# EAGLE design perica3 (EAGLE 7.7.0)
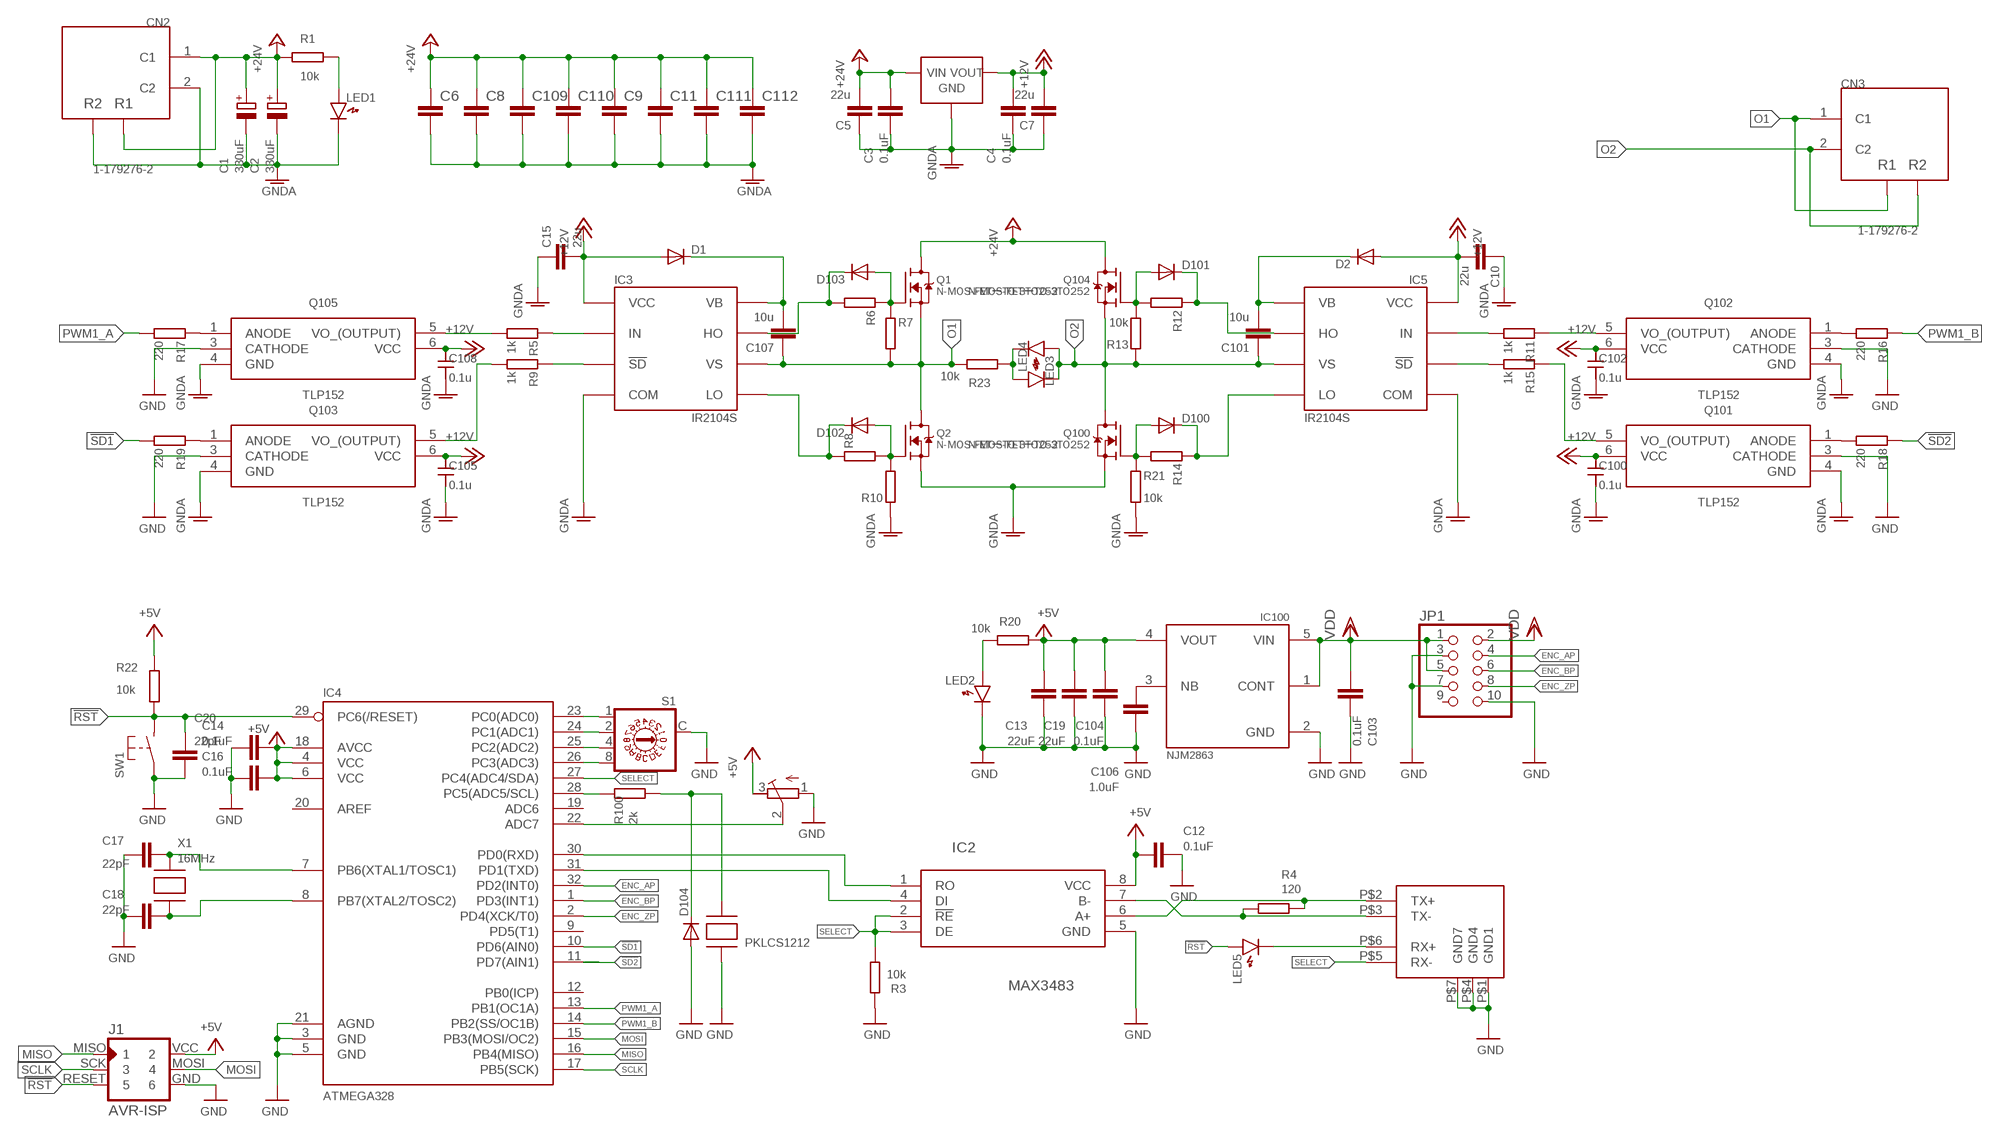
[diagram p0: schematic, sheet 1]

## Parts
C1  330uF  CPOL-EUUD-10X10  [UD-10X10_NICHICON]
C2  330uF  CPOL-EUUD-10X10  [UD-10X10_NICHICON]
C3  0.1uF  C-EUC0603K  [C0603K]
C4  0.1uF  C-EUC0603K  [C0603K]
C5  22u  C-EUC1206K  [C1206K]
C6  C-EUC1206  [C1206]
C7  22u  C-EUC1206K  [C1206K]
C8  C-EUC1206  [C1206]
C9  C-EUC1206  [C1206]
C10  22u  C-EUC1206K  [C1206K]
C11  C-EUC1206  [C1206]
C12  0.1uF  C-EUC0603K  [C0603K]
C13  22uF  C-EUC0805K  [C0805K]
C14  0.1uF  C-EUC0603K  [C0603K]
C15  22u  C-EUC1206K  [C1206K]
C16  0.1uF  C-EUC0603K  [C0603K]
C17  22pF  C-EUC0603K  [C0603K]
C18  22pF  C-EUC0603K  [C0603K]
C19  22uF  C-EUC0805K  [C0805K]
C20  22pF  C-EUC0603K  [C0603K]
C100  0.1u  CAPACTOR1608  [SMD1608]
C101  10u  C-EUC1206K  [C1206K]
C102  0.1u  CAPACTOR1608  [SMD1608]
C103  0.1uF  C-EUC0603K  [C0603K]
C104  0.1uF  C-EUC0603K  [C0603K]
C105  0.1u  CAPACTOR1608  [SMD1608]
C106  1.0uF  C-EUC0603K  [C0603K]
C107  10u  C-EUC1206K  [C1206K]
C108  0.1u  CAPACTOR1608  [SMD1608]
C109  C-EUC1206  [C1206]
C110  C-EUC1206  [C1206]
C111  C-EUC1206  [C1206]
C112  C-EUC1206  [C1206]
CN1  SATA  [SATA_MOLEX_LLC_0470804001]
CN2  1-179276-2  [1-179276-2]
CN3  1-179276-2  [1-179276-2]
D1  DIODE-SOD123  [SOD123]
D2  DIODE-SOD123  [SOD123]
D100  DIODE-SOD123  [SOD123]
D101  DIODE-SOD123  [SOD123]
D102  DIODE-SOD123  [SOD123]
D103  DIODE-SOD123  [SOD123]
D104  DIODE-SOD123  [SOD123]
IC1  NJM78XX  [TO252]
IC2  MAX3483  MAX3488  [SO-8]
IC3  IR2104S  [SO-8]
IC4  ATMEGA328  [TQFP32-08]
IC5  IR2104S  [SO-8]
IC100  NJM2863  [SOT-23-5]
J1  AVR-ISP  AVR-ISP-6PINAVR-ISP-6PIN-SMALL-SILK  [AVR-ISP-6PIN-SMAILL-SILK]
JP1  PINHD-2X5  [2X05]
LED1  RED  LED  [LED_1608]
LED2  RED  LED  [LED_1608]
LED3  RED  LED  [LED_1608]
LED4  RED  LED  [LED_1608]
LED5  RED  LED  [LED_1608]
Q1  N-MOS-FETーTO-3TO252  [TO252]
Q2  N-MOS-FETーTO-3TO252  [TO252]
Q100  N-MOS-FETーTO-3TO252  [TO252]
Q101  TLP152  TLP2309  [11-4L1S(5-PIN-SOIC)]
Q102  TLP152  TLP2309  [11-4L1S(5-PIN-SOIC)]
Q103  TLP152  TLP2309  [11-4L1S(5-PIN-SOIC)]
Q104  N-MOS-FETーTO-3TO252  [TO252]
Q105  TLP152  TLP2309  [11-4L1S(5-PIN-SOIC)]
R1  10k  REGISTER1068  [SMD1608]
R2  10k-20k  R-TRIMM4G/J  [RTRIM4G/J]
R3  10k  REGISTER1068  [SMD1608]
R4  120  REGISTER1068  [SMD1608]
R5  1k  REGISTER1068  [SMD1608]
R6  REGISTER1068  [SMD1608]
R7  REGISTER1068  [SMD1608]
R8  REGISTER1068  [SMD1608]
R9  1k  REGISTER1068  [SMD1608]
R10  REGISTER1068  [SMD1608]
R11  1k  REGISTER1068  [SMD1608]
R12  REGISTER1068  [SMD1608]
R13  10k  REGISTER1068  [SMD1608]
R14  REGISTER1068  [SMD1608]
R15  1k  REGISTER1068  [SMD1608]
R16  220  REGISTER1068  [SMD1608]
R17  220  REGISTER1068  [SMD1608]
R18  220  REGISTER1068  [SMD1608]
R19  220  REGISTER1068  [SMD1608]
R20  10k  REGISTER1068  [SMD1608]
R21  10k  REGISTER1068  [SMD1608]
R22  10k  REGISTER1068  [SMD1608]
R23  10k  REGISTER1068  [SMD1608]
R100  2k  REGISTER1068  [SMD1608]
S1  P103  [P103]
SW1  TUCT_SW_MINI  [SW1]
X1  16MHz  XTALNX5032  [NX5032]
Z1  PKLCS1212  [PKLCS1212]

## Nets
!RST: C20.2 IC4.29(PC6(/RESET)) J1.RESET LED5.A R22.1 SW1.P$2(S)
!SD1: IC4.10(PD6(AIN0)) R19.2
!SD2: IC4.11(PD7(AIN1)) R18.1
+5V: C12.2 C13.1 C14.2 C16.2 C19.1 C104.2 IC2.8(VCC) IC4.4(VCC) IC4.6(VCC) IC4.18(AVCC) IC100.4(VOUT) J1.VCC R2.3(E) R20.2 R22.2
+12V: C4.2 C7.2 C10.2 C15.2 C100.1 C102.1 C105.1 C108.1 D1.A D2.A IC1.2(VOUT) IC3.1(VCC) IC5.1(VCC) Q101.6(VCC) Q102.6(VCC) Q103.6(VCC) Q105.6(VCC)
+24V: C1.+ C2.+ C3.2 C5.2 C6.1 C8.1 C9.1 C11.1 C109.1 C110.1 C111.1 C112.1 CN2.1(C1) CN2.4(R1) IC1.1(VIN) Q1.3(D) Q104.3(D) R1.2
ENC_AP: IC4.32(PD2(INT0)) JP1.4
ENC_BP: IC4.1(PD3(INT1)) JP1.6
ENC_ZP: IC4.2(PD4(XCK/T0)) JP1.8
G1_HIS: D103.A Q1.1(G) R6.1 R7.1
G1_LOS: D100.A Q100.1(G) R14.2 R21.1
G2_HIS: D101.A Q104.1(G) R12.2 R13.2
G2_LOS: D102.A Q2.1(G) R8.2 R10.2
GND: C12.1 C13.2 C14.1 C16.1 C17.1 C18.1 C19.2 C20.1 C103.1 C104.1 C106.1 CN1.P$1(GND1) CN1.P$4(GND4) CN1.P$7(GND7) D104.A IC2.5(GND) IC4.3(GND) IC4.5(GND) IC4.21(AGND) IC100.2(GND) J1.GND JP1.3 JP1.7 JP1.10 LED2.K Q101.3(CATHODE) Q102.3(CATHODE) Q103.3(CATHODE) Q105.3(CATHODE) R2.1(A) R3.2 S1.C SW1.P$1(P) Z1.P$2
GNDA: C1.- C2.- C3.1 C4.1 C5.1 C6.2 C7.1 C8.2 C9.2 C10.1 C11.2 C15.1 C100.2 C102.2 C105.2 C108.2 C109.2 C110.2 C111.2 C112.2 CN2.2(C2) CN2.3(R2) IC1.3(GND) IC3.4(COM) IC5.4(COM) LED1.K Q2.2(S) Q100.2(S) Q101.4(GND) Q102.4(GND) Q103.4(GND) Q105.4(GND) R10.1 R21.2
MISO: IC4.16(PB4(MISO)) J1.MISO
MOSI: IC4.15(PB3(MOSI/OC2)) J1.MOSI
N$1: IC3.2(IN) R5.1
N$2: IC4.26(PC3(ADC3)) S1.8
N$3: IC4.25(PC2(ADC2)) S1.4
N$4: C107.2 D1.C IC3.8(VB)
N$5: D103.C IC3.7(HO) R6.2
N$6: C17.2 IC4.7(PB6(XTAL1/TOSC1)) X1.P$2
N$7: C18.2 IC4.8(PB7(XTAL2/TOSC2)) X1.P$1
N$8: D101.C IC5.7(HO) R12.1
N$9: IC4.24(PC1(ADC1)) S1.2
N$10: D100.C IC5.5(LO) R14.1
N$11: D102.C IC3.5(LO) R8.1
N$12: IC4.23(PC0(ADC0)) S1.1
N$13: C101.2 D2.C IC5.8(VB)
N$14: IC3.3(!SD) R9.1
N$15: IC5.2(IN) R11.2
N$16: IC5.3(!SD) R15.2
N$17: Q105.1(ANODE) R17.1
N$18: Q102.5(VO_(OUTPUT)) R11.1
N$19: Q101.5(VO_(OUTPUT)) R15.1
N$20: Q105.5(VO_(OUTPUT)) R5.2
N$21: Q103.5(VO_(OUTPUT)) R9.2
N$22: Q103.1(ANODE) R19.1
N$23: Q102.1(ANODE) R16.2
N$24: Q101.1(ANODE) R18.2
N$25: IC4.28(PC5(ADC5/SCL)) R100.2
N$26: D104.C R100.1 Z1.P$1
N$27: LED2.A R20.1
N$28: CN1.P$6(RX+) LED5.K
N$29: C106.2 IC100.3(NB)
N$30: LED1.A R1.1
N$31: CN1.P$2(TX+) IC2.6(A+) R4.1
N$32: LED3.K LED4.A R23.2
N$33: IC4.22(ADC7) R2.2(S)
N$34: CN1.P$3(TX-) IC2.7(B-) R4.2
O1: C107.1 CN3.1(C1) CN3.4(R1) IC3.6(VS) Q1.2(S) Q2.3(D) R7.2 R23.1
O2: C101.1 CN3.2(C2) CN3.3(R2) IC5.6(VS) LED3.A LED4.K Q100.3(D) Q104.2(S) R13.1
PWM1_A: IC4.13(PB1(OC1A)) R17.2
PWM1_B: IC4.14(PB2(SS/OC1B)) R16.1
RXD: IC2.4(DI) IC4.31(PD1(TXD))
SCLK: IC4.17(PB5(SCK)) J1.SCK
SELECT: CN1.P$5(RX-) IC2.2(!RE) IC2.3(DE) IC4.27(PC4(ADC4/SDA)) R3.1
TXD: IC2.1(RO) IC4.30(PD0(RXD))
VDD: C103.2 IC100.1(CONT) IC100.5(VIN) JP1.1 JP1.2 JP1.5
Unconnected: IC4.9(PD5(T1)) IC4.12(PB0(ICP)) IC4.19(ADC6) IC4.20(AREF) JP1.9

## Library data of the parts
C1 C2 = rcl:CPOL-EU: POLARIZED CAPACITOR, European symbol
C3 C4 C12-C14 C16-C20 C103 C104 C106 = resistor:C-EU: CAPACITOR, European symbol
C5-C11 C15 C101 C107 C109-C112 = rcl:C-EU: CAPACITOR, European symbol
C100 C102 C105 C108 = FUGU_GENERIC:CAPACTOR
CN1 = FUGU:SATA: Seriaal ATA Connecter
CN2 CN3 = FUGU:1-179276-2: AMP DYNAMIC D-3200; MANUFACTURER_PART_NUMBER: 11792762; VENDOR: Tyco Electronics
D1 D2 D100-D104 = diode:DIODE-: DIODE
IC1 = FUGU_LSI:NJM78XX
IC2 = FUGU_LSI:MAX3488: 3.3V-Powered, 10Mbps and Slew-Rate-Limited True RS-485/RS-422 Transceivers
IC3 IC5 = FUGU_LSI:IR2104: high voltage, high speed power MOSFET and IGBT drivers.
IC4 = FUGU_LSI:ATMEGA328: High Performance, Low Power AVR 8-Bit Microcontroller
IC100 = FUGU_LSI:NJM2863: Low Noize Low Drop Out Voltage Regulator
J1 = avr-isp:AVR-ISP-6PIN: AVR ISP 6pin 3x2 pin header
JP1 = pinhead:PINHD-2X5: PIN HEADER
LED1-LED5 = FUGU_GENERIC:LED
Q1 Q2 Q100 Q104 = FUGU:N-MOS-FETーTO-3: Nchannel MOS FET
Q101-Q103 Q105 = TLP2309:TLP2309: Toshiba TLP2309 AC Input Transistor Output Optocoupler, Surface Mount, 5-Pin SOIC <https://componentsearchengine.com/Images/3/TLP2309.jpg> Source: Datasheet <https://toshiba.semicon-storage.com/info/docget.jsp?did=8380&prodName=TLP2309>; DESCRIPTION: Toshiba TLP2309 AC Input Transistor Output Optocoupler, Surface Mount, 5-Pin SOIC; HEIGHT: mm; MANUFACTURER_NAME: Toshiba; MANUFACTURER_PART_NUMBER: TLP2309; RS_PART_NUMBER: 7965241P; SUPPLIER_NAME: RS
R1 R3-R23 R100 = FUGU_GENERIC:REGISTER
R2 = resistor:R-TRIMM: Trimm resistor
S1 = switch-dil:P103: DIL/CODE SWITCH; OC_FARNELL: unknown; OC_NEWARK: unknown
SW1 = FUGU:TUCT_SW_MINI: TVBP06
X1 = adafruit:XTAL: Low cost SMT crystals, no capacitors included http://www.ladyada.net/library/eagle
Z1 = FUGU:PKLCS1212: murata small piezoelectric buzzer

## Board
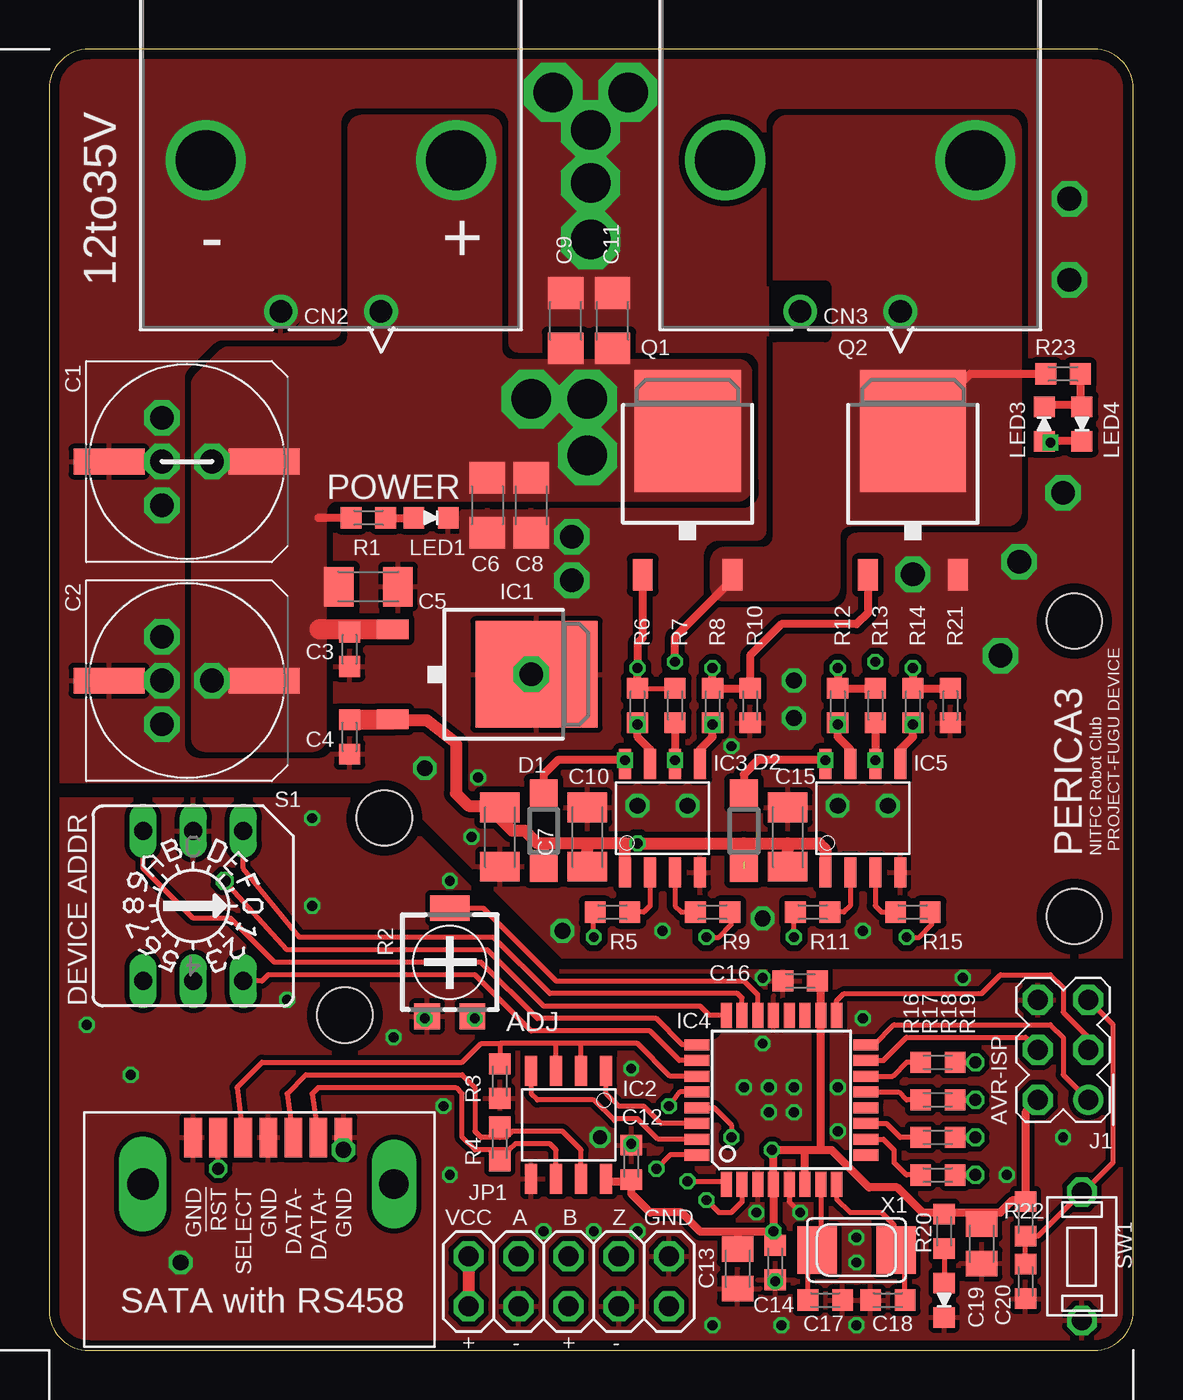
[diagram p1: board, top side]
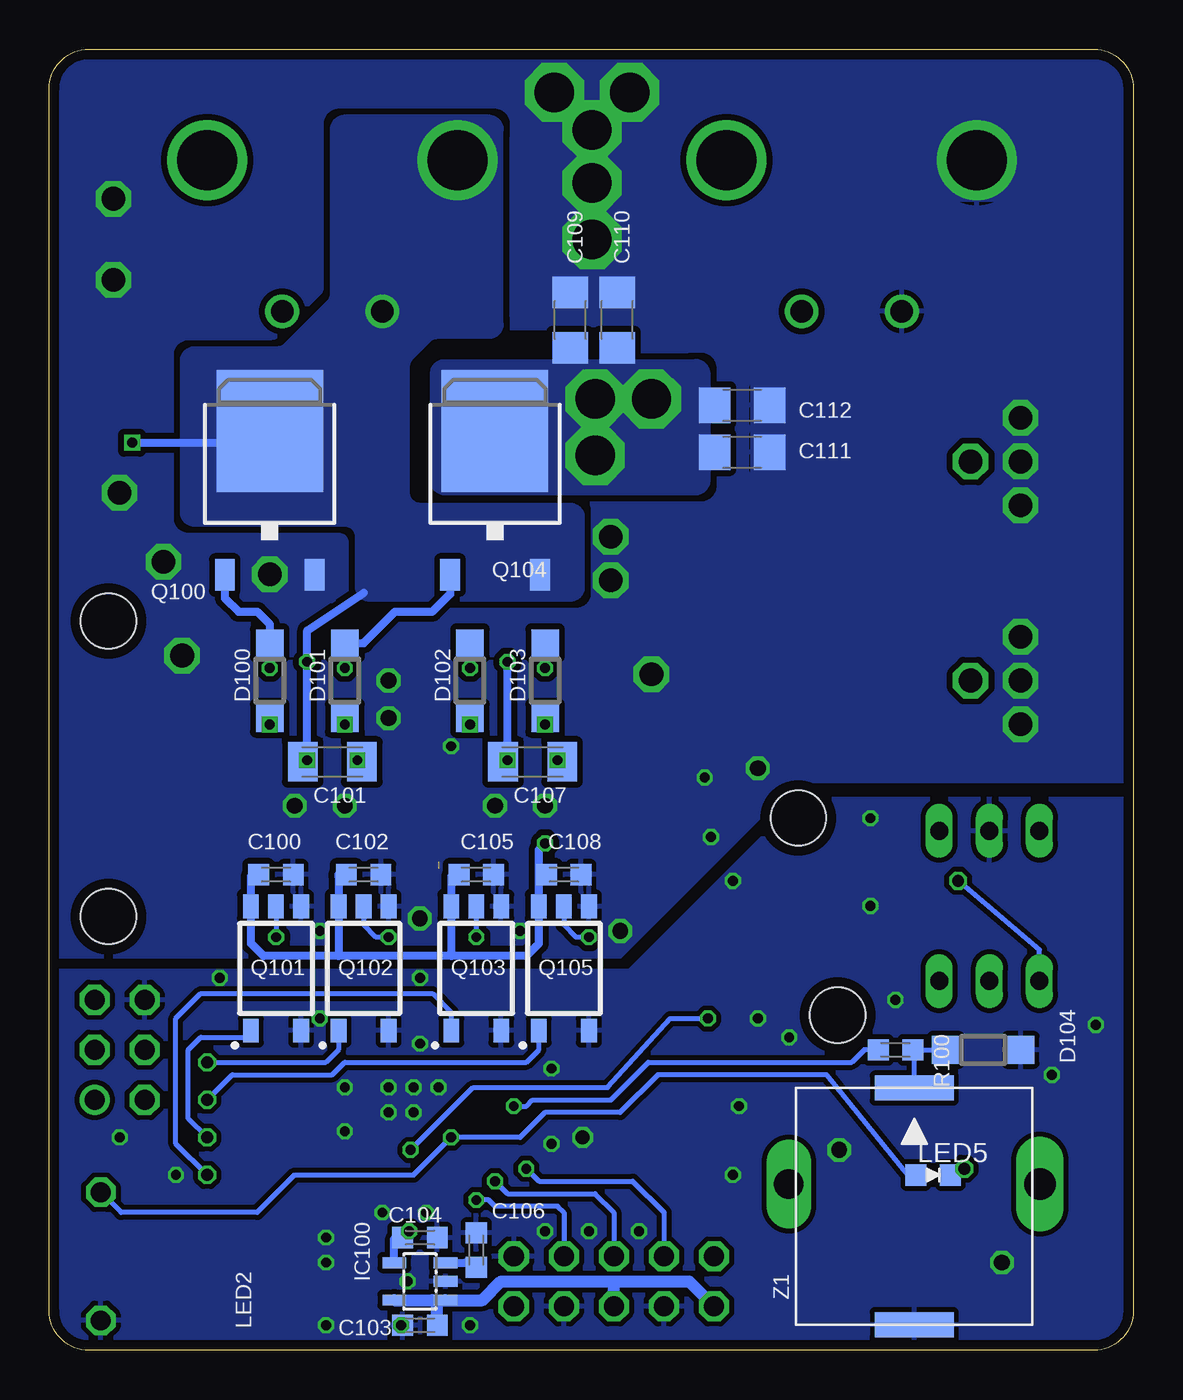
[diagram p2: board, bottom side, seen from below]

Size 55 x 66 mm. Coordinates in mm from the lower left corner, seen from the top.
Outline: 2,0 53,0 arc90 55,2 55,64 arc90 53,66 2,66 arc90 0,64 0,2 arc90 2,0
Copper layers (1*16): Top 0.035mm / dielectric 1.6mm / Bottom 0.035mm
Design rules "Elecrow_2-layer_PCB_eagle_rule": minimum track width 6mil, minimum drill 12mil, track to track 6mil, track to pad 6mil, pad to pad 6mil, via to via 8mil, smd to smd 0mil, copper to edge 20mil, drill to drill 10mil, minimum pad ring 6mil, minimum via ring 6mil, stop-mask expansion 0mil, vias tented up to drill 100mil, thermal gap 10mil
Holes 2.8 mm at 15,17 52,22 17,27 52,37
tRestrict: area 36.8,51.4 to 39.4,54; 4 lines
bRestrict: 1 lines

### Footprints (pad centres in the part's own frame; a part is rotated, then mirrored left to right if it is on the bottom)
UD-10X10_NICHICON = smd 3.6 x 1.3: + 3.925,0; - -3.95,0
C0603K = smd 1.05 x 1.08: 1 -0.875,0; 2 0.875,0
C1206K = smd 1.5 x 2: 1 -1.5,0; 2 1.5,0
C1206 = smd 1.6 x 1.8: 1 -1.4,0; 2 1.4,0
C0805K = smd 1.3 x 1.6: 1 -1,0; 2 1,0
SMD1608 = smd 1.05 x 1.08: 1 -0.875,0; 2 0.875,0
SATA_MOLEX_LLC_0470804001 = smd 0.9 x 2: P$1 3.81,5.08; P$2 2.54,5.08; P$3 1.27,5.08; P$4 0,5.08; P$5 -1.27,5.08; P$6 -2.54,5.08; P$7 -3.81,5.08 | drill 1.6 long: P$8 -6.37,2.72 | drill 1.5 long: P$9 6.37,2.72
1-179276-2 = drill 1.143 pad 1.397: 1 5.08,0; 2 0,0 | drill 3.048 pad 3.556: 3 -3.81,7.671; 4 8.89,7.671
SOD123 = smd 1.4 x 1.4: A 1.9,0; C -1.9,0
TO252 = smd 1 x 1.6: 1 -2.28,-4.8; 2 2.28,-4.8 | smd 5.4 x 6.2: 3 0,2.5
SO-8 = smd 1.524 x 0.61: 1 -2.743,1.905; 2 -2.743,0.635; 3 -2.743,-0.635; 4 -2.743,-1.905; 5 2.743,-1.905; 6 2.743,-0.635; 7 2.743,0.635; 8 2.743,1.905
TQFP32-08 = smd 1.27 x 0.559: 1 -4.293,2.8; 2 -4.293,2; 3 -4.293,1.2; 4 -4.293,0.4; 5 -4.293,-0.4; 6 -4.293,-1.2; 7 -4.293,-2; 8 -4.293,-2.8; 17 4.293,-2.8; 18 4.293,-2; 19 4.293,-1.2; 20 4.293,-0.4; 21 4.293,0.4; 22 4.293,1.2; 23 4.293,2; 24 4.293,2.8 | smd 0.559 x 1.27: 9 -2.8,-4.293; 10 -2,-4.293; 11 -1.2,-4.293; 12 -0.4,-4.293; 13 0.4,-4.293; 14 1.2,-4.293; 15 2,-4.293; 16 2.8,-4.293; 25 2.8,4.293; 26 2,4.293; 27 1.2,4.293; 28 0.4,4.293; 29 -0.4,4.293; 30 -1.2,4.293; 31 -2,4.293; 32 -2.8,4.293
SOT-23-5 = smd 0.55 x 1.2: 1 -0.95,-1.3; 2 0,-1.3; 3 0.95,-1.3; 4 0.95,1.3; 5 -0.95,1.3
AVR-ISP-6PIN-SMAILL-SILK = drill 1.016 octagon: GND 1.27,-2.54; MOSI 1.27,0; RESET -1.27,-2.54; SCK -1.27,0; VCC 1.27,2.54 | drill 1.016: MISO -1.27,2.54
2X05 = drill 1.016 octagon: 1 -5.08,-1.27; 2 -5.08,1.27; 3 -2.54,-1.27; 4 -2.54,1.27; 5 0,-1.27; 6 0,1.27; 7 2.54,-1.27; 8 2.54,1.27; 9 5.08,-1.27; 10 5.08,1.27
LED_1608 = smd 1.05 x 1.08: A -0.875,0; K 0.875,0
11-4L1S(5-PIN-SOIC) = smd 0.8 x 1.2: 1 -1.27,-3.15; 3 1.27,-3.15; 4 1.27,3.15; 5 0,3.15; 6 -1.27,3.15
RTRIM4G/J = smd 1.3 x 1.3: 1 -1.15,-2.75; 3 1.15,-2.75 | smd 2 x 1.3: 2 0,2.75
P103 = drill 0.914 long: 1 3.81,-2.54; 2 -3.81,2.54; 4 3.81,2.54; 8 -3.81,-2.54; C 3.81,0; C1 -3.81,0
SW1 = drill 1 octagon: P$1 0,-3.25; P$2 0,3.25
NX5032 = smd 2 x 2.4: P$1 2,0; P$2 -2,0
PKLCS1212 = smd 1.27 x 4: P$1 6,0; P$2 -6,0

### Placement (x,y rotation side)
C1  6.99,45.09 0 top
C2  6.99,33.97 0 top
C3  15.24,35.56 90 top
C4  15.24,31.11 90 top
C5  16.19,38.73 180 top
C6  22.23,42.86 270 top
C7  22.86,26.04 90 top
C8  24.45,42.86 270 top
C9  26.19,52.23 90 top
C10  27.3,26.04 270 top
C11  28.57,52.23 90 top
C12  29.53,9.53 270 top
C13  34.92,4.13 270 top
C14  36.83,4.45 90 top
C15  37.47,26.04 270 top
C16  38.1,18.73 0 top
C17  39.37,2.54 180 top
C18  42.55,2.54 0 top
C19  47.31,5.4 270 top
C20  49.53,3.49 90 top
C100  43.5,24.13 0 bottom
C101  40.64,29.84 0 bottom
C102  39.05,24.13 0 bottom
C103  36.2,1.27 0 bottom
C104  36.2,5.71 180 bottom
C105  33.34,24.13 0 bottom
C106  33.34,5.08 270 bottom
C107  30.48,29.84 0 bottom
C108  28.89,24.13 0 bottom
C109  28.57,52.26 90 bottom
C110  26.19,52.26 90 bottom
C111  19.84,45.56 0 bottom
C112  19.84,47.94 0 bottom
CN1  11.11,5.71 0 top
CN2  11.75,52.7 0 top
CN3  38.1,52.7 0 top
D1  25.08,26.35 270 top
D2  35.24,26.35 270 top
D100  43.81,33.97 90 bottom
D101  40.01,33.97 90 bottom
D102  33.66,33.97 90 bottom
D103  29.84,33.97 90 bottom
D104  7.62,15.24 0 bottom
IC1  22.23,34.29 270 top
IC2  26.35,11.43 270 top
IC3  31.11,26.99 90 top
IC4  37.15,12.7 90 top
IC5  41.27,26.99 90 top
IC100  36.2,3.49 90 bottom
J1  51.44,15.24 180 top
JP1  26.35,3.49 0 top
LED1  19.37,42.23 0 top
LED2  45.4,2.54 270 top
LED3  50.48,46.99 90 top
LED4  52.39,46.99 270 top
LED5  10.16,8.89 0 bottom
Q1  32.38,44.13 0 top
Q2  43.81,44.13 0 top
Q100  43.81,44.13 0 bottom
Q101  43.5,19.37 0 bottom
Q102  39.05,19.37 0 bottom
Q103  33.34,19.37 0 bottom
Q104  32.38,44.13 0 bottom
Q105  28.89,19.37 0 bottom
R1  16.19,42.23 180 top
R2  20.32,19.68 0 top
R3  22.86,13.65 270 top
R4  22.86,10.48 90 top
R5  28.57,22.23 180 top
R6  29.84,32.7 270 top
R7  31.75,32.7 270 top
R8  33.66,32.7 90 top
R9  33.66,22.23 0 top
R10  35.56,32.7 90 top
R11  38.73,22.23 0 top
R12  40.01,32.7 90 top
R13  41.91,32.7 90 top
R14  43.81,32.7 90 top
R15  43.81,22.23 180 top
R16  45.09,14.61 0 top
R17  45.09,12.7 180 top
R18  45.09,10.79 0 top
R19  45.09,8.89 180 top
R20  45.4,6.03 90 top
R21  45.72,32.7 270 top
R22  49.53,6.67 90 top
R23  51.44,49.53 0 top
R100  12.06,15.24 180 bottom
S1  7.3,22.54 90 top
SW1  52.39,4.76 0 top
X1  40.96,5.08 0 top
Z1  11.11,7.3 90 bottom

### Tracks (layer width: path | path; a pad name or v marks a point on that pad's centre or on a via)
!RST  (via drill 0.5)
  Top 0.254: C20.2 R22.1 50.17,5.79 SW1.P$2 52.46,8.01 53.98,9.53 53.98,16.51 J1.RESET | IC4.29 33.74,12.3 34.61,11.43 v34.61,10.79
  Bottom 0.254: SW1.P$2 51.36,6.99 44.45,6.99 42.55,8.89 36.51,8.89 v34.61,10.79 31.11,10.79 29.84,12.06 26.04,12.06 24.13,13.97 15.56,13.97 11.43,8.89 LED5.A
!SD1
  Top 0.254: R19.2 43.5,8.89 42.86,9.53 42.86,10.16 42.32,10.7 IC4.10
!SD2
  Top 0.254: R18.1 43.18,10.79 42.48,11.5 IC4.11
+5V  (via drill 0.5)
  Top 0.254: 39.15,10.26 39.69,10.16 | R2.3 21.48,16.93 v21.59,16.83
  Top 0.406: 38.26,10.16 v36.67,10.16 36.75,10.08 IC4.4 v36.75,6.03 | 38.26,10.16 39.69,10.16 41.59,8.26 43.02,8.26 44.29,6.99 45.33,6.99 | 39.15,10.26 IC4.18 39.15,18.56 C16.2 | 45.33,6.99 47.62,6.99 | J1.VCC 49.53,12.06 R22.2 49.45,7.62 48.9,7.62 48.26,6.99 47.62,6.99 | C19.1 47.62,6.99 | 29.56,8.69 C12.2 | 28.29,8.65 IC2.8 28.37,8.57 29.21,8.57 29.21,8.37 | C12.2 29.21,8.37 | 29.21,8.37 29.32,8.37 | 45.33,6.99 R20.2 | 34.92,6.03 v36.75,6.03 | 34.92,6.03 33.02,6.03 32.07,6.99 30.48,6.99 29.53,7.94 C12.2 | 34.92,6.03 C13.1 | v36.75,6.03 36.75,5.4 C14.2 | IC4.6 38.35,10.09 38.26,10.16
  Top 0.61: 29.61,8.57 C12.2
  Bottom 0.254: v36.67,10.16 33.5,13.34 26.67,13.34 23.5,16.83 v21.59,16.83 | C104.2 v36.75,6.03
  Bottom 0.406: IC100.4 37.49,5.67 C104.2 37.23,5.79
+12V  (via drill 0.5)  (1 unrouted)
  Top 0.152: 35.56,24.77 D2.A
  Top 0.61: 29.21,25.72 v29.84,25.72 35.24,25.72 | 35.24,25.72 37.47,25.72 | 37.47,25.72 39.05,25.72 39.37,25.4 IC5.1 | C15.2 37.47,25.72 | IC3.1 29.21,25.72 | 29.21,25.72 27.3,25.72 | 27.3,25.72 25.08,25.72 | 25.08,25.72 24.77,25.72 24.13,26.35 23.5,26.35 22.86,26.99 C7.2 22.77,27.62 21.27,27.62 20.64,28.26 20.64,30.8 19.14,31.97 17.46,31.97 IC1.2 | C10.2 27.3,25.72 | 35.24,25.72 35.24,24.77 | D1.A 25.08,25.72
  Top 1.016: C4.2 17.41,31.99 IC1.2
  Bottom 0.406: C105.1 34.61,24.05 Q103.6 34.61,20 | 40.32,24.05 C102.1 40.32,24.13 Q102.6 40.32,20 | C100.1 44.77,24.05 Q101.6 44.77,20.64 44.13,20 40.32,20 | 34.61,20 40.32,20 | 34.61,20 30.8,20 30.16,20.64 Q105.6 30.16,24.05 C108.1 30.16,24.13 30.16,25.4 v29.84,25.72
+24V  (via drill 1.2, 2)
  Top 0.406: 13.71,36.57 15.24,36.57 C3.2 | R1.2 13.65,42.23
  Top 1.016: IC1.1 13.71,36.57
  other vias: 27.3,48.26 27.3,45.4 24.45,48.26 8.26,45.09 8.26,33.97
  pour Bottom (isolate 0.305, no thermals): 21.59,49.53 21.59,44.13 arc90 22.23,43.5 34.92,43.5 arc90 35.56,44.13 35.56,49.53 arc90 34.92,50.16 22.23,50.16 arc90
  pour Top (isolate 0.254, no thermals): 22.23,62.55 15.88,62.55 arc90 15.24,61.91 15.24,51.44 arc-90 14.61,50.8 9.15,50.8 arc45 8.7,50.61 7.49,49.4 arc45 7.3,48.95 7.3,31.11 arc90 7.94,30.48 13.34,30.48 arc90 13.97,31.11 13.97,42.55 arc-90 14.61,43.18 34.92,43.18 arc90 35.56,43.81 35.56,49.53 arc90 34.92,50.16 23.5,50.16 arc-90 22.86,50.8 22.86,61.91 arc90
  pour Top (isolate 0.254, no thermals): 22.23,62.55 15.88,62.55 arc90 15.24,61.91 15.24,51.44 arc-90 14.61,50.8 9.15,50.8 arc45 8.7,50.61 7.49,49.4 arc45 7.3,48.95 7.3,31.11 arc90 7.94,30.48 13.34,30.48 arc90 13.97,31.11 13.97,42.55 arc-90 14.61,43.18 34.92,43.18 arc90 35.56,43.81 35.56,49.53 arc90 34.92,50.16 23.5,50.16 arc-90 22.86,50.8 22.86,61.91 arc90
ENC_AP  (via drill 0.5)
  Top 0.254: IC4.32 31.49,9.9 v30.8,9.21
  Bottom 0.254: v30.8,9.21 30.16,8.57 25.4,8.57 23.81,6.99 JP1.4
ENC_BP  (via drill 0.5)
  Top 0.254: v32.38,8.57 34.18,8.57 IC4.1
  Bottom 0.254: v32.38,8.57 31.75,7.94 27.3,7.94 26.35,6.99 JP1.6
ENC_ZP  (via drill 0.5)
  Top 0.254: v33.34,7.62 33.97,6.99 34.61,6.99 35.15,7.53 IC4.2
  Bottom 0.254: JP1.8 28.89,6.99 29.21,7.3 32.38,7.3 32.7,7.62 v33.34,7.62
G1_HIS  (via drill 0.5)
  Top 0.254: R6.1 R7.1
  Top 0.406: R6.1 v29.84,34.61 D103.A 30.11,36.13 Q1.1
  Bottom 0.406: v29.84,34.61 D103.A
G1_LOS  (via drill 0.5)
  Top 0.406: R21.1 R14.2 v43.81,34.61
  Bottom 0.406: v43.81,34.61 D100.A 43.81,36.83 44.45,37.47 45.4,37.47 46.09,38.16 Q100.1
G2_HIS  (via drill 0.5)
  Top 0.406: R13.2 R12.2 v40.01,34.61
  Bottom 0.406: v40.01,34.61 D101.A 39.05,35.88 37.47,37.47 35.56,37.47 34.66,38.36 Q104.1
G2_LOS  (via drill 0.5)
  Top 0.406: v33.66,34.61 R8.2 R10.2 35.56,35.24 37.15,36.83 40.96,36.83 41.53,37.41 Q2.1
  Bottom 0.406: v33.66,34.61 D102.A
GND  (via drill 0.5, 0.7, 0.8)
  Top 0.254: IC4.5 37.55,7.54 v38.1,6.99
  other vias: 36.51,13.34 46.35,18.89 48.58,8.89 13.34,26.99 40.96,4.45 20.32,8.89 35.24,13.34 20,12.38 36.2,18.89 19.05,16.83 29.53,10.48 51.44,10.79 37.78,13.34 36.51,12.06 37.78,12.06 40.01,13.34 40.01,11.11 41.27,16.83 4.13,13.97 14.92,10.16 1.91,16.51 37.15,1.27 20.32,23.81 13.34,22.54 27.94,10.79 12.06,17.78 17.46,15.88 40.96,5.71 35.88,6.99 6.67,4.45 40.96,1.27 29.84,6.03 27.62,6.03 25.08,6.03 36.83,3.49 33.66,1.27 36.2,15.56 29.53,14.29
  pour Top (isolate 0.254, rank 2): -1.27,27.94 16.83,27.94 25.56,19.21 56.2,19.21 56.2,-0.95 -1.27,-0.95
  pour Bottom (isolate 0.254, rank 2): -1.27,27.94 16.83,27.94 25.56,19.21 56.2,19.21 56.2,-0.95 -1.27,-0.95
GNDA  (via drill 0.5, 0.8, 1.2, 2)
  Bottom 0.406: C108.2 28.34,23.89 28.26,24.13
  other vias: 26.51,41.27 26.51,39.05 5.71,47.31 5.71,42.86 51.44,43.5 48.26,35.24 36.2,21.91 32.38,27.62 42.55,27.62 37.78,33.97 37.78,32.07 51.75,58.42 51.75,54.29 43.81,39.37 49.21,40.01 26.04,21.27 5.71,36.2 5.71,31.75 24.45,34.29 27.46,61.91 27.46,59.21 27.46,56.36 5.71,33.97 5.71,45.09 29.84,27.62 40.01,27.62 19.05,29.53 25.56,63.82 29.37,63.82 31.11,21.27 41.27,21.27 21.43,26.04 21.75,29.05 34.61,30.64
  pour Bottom (isolate 0.305, rank 2): -1.27,66.67 56.04,66.67 56.2,20 26.04,20 17.14,28.89 -1.27,28.89
  pour Top (isolate 0.305, rank 2): -1.27,28.89 17.14,28.89 26.04,20 56.2,20 56.04,66.67 -1.27,66.67
  pour Top (isolate 0.305, no thermals): 12.06,52.07 4.45,52.07 arc-90 3.81,52.7 3.81,64.14 arc-90 4.45,64.77 12.06,64.77 arc-90 12.7,64.14 12.7,52.7 arc-90
  pour Bottom (isolate 0.254, no thermals): 40.64,38.1 40.64,40.01 arc-90 41.27,40.64 42.55,40.64 42.55,38.1
  pour Top (isolate 0.254, no thermals): 45.09,40.64 46.99,40.64 46.99,38.1 45.09,38.1
  pour Bottom (isolate 0.305, no thermals): 5.4,63.82 10.48,63.82 10.48,58.42 5.4,58.42
  pour Bottom (no thermals): 25.43,54.86 30,54.86 30,52.58 25.15,52.58 25.15,54.86
  pour Bottom (no thermals): 17.05,44.35 17.05,49.21 19.34,49.21 19.34,44.35
  pour Top (no thermals): 25.08,54.61 29.84,54.61 29.84,52.39 25.08,52.39
  pour Top (no thermals): 20.95,42.55 25.72,42.55 25.72,40.32 20.95,40.32
MISO
  Top 0.254: IC4.16 41.85,15.5 42.86,16.51 50.8,16.51 51.44,15.88 51.44,13.97 J1.MISO
MOSI
  Top 0.254: IC4.15 42.32,14.7 43.5,15.88 49.53,15.88 J1.MOSI
N$1
  Top 0.254: IC3.2 30.48,22.54 30.16,22.23 R5.1
N$2
  Top 0.254: S1.8 10.79,18.73 11.11,19.05 21.59,19.05 24.45,16.19 30.48,16.19 31.97,14.7 IC4.26
N$3
  Top 0.254: S1.4 4.76,24.45 7.3,21.91 9.21,21.91 11.43,19.68 21.91,19.68 24.77,16.83 30.8,16.83 32.12,15.5 IC4.25
N$4  (via drill 0.5)
  Top 0.254: IC3.8 v29.21,29.93
  Top 0.406: v29.21,29.93 25.8,29.93 25.08,29.21 D1.C
  Bottom 0.254: v29.21,29.93 29.07,29.93 C107.2
N$5  (via drill 0.5)
  Top 0.254: v29.84,31.75 R6.2
  Top 0.406: IC3.7 30.48,30.48 29.84,31.11 v29.84,31.75
  Bottom 0.152: v29.84,31.75 D103.C
N$6
  Top 0.254: C17.2 38.49,4.62 X1.P$2 39.15,5.27 IC4.7
N$7
  Top 0.254: IC4.8 39.95,7.68 40.64,6.99 42.23,6.99 42.86,6.35 42.86,5.17 X1.P$1 43.42,4.62 C18.2
N$8  (via drill 0.5)
  Top 0.254: IC5.7 40.64,30.48
  Top 0.406: 40.64,30.48 40.01,31.11 v40.01,31.75 R12.1
  Bottom 0.152: D101.C
  Bottom 0.254: v40.01,31.75 D101.C
N$9  (via drill 0.6)
  Top 0.254: v8.89,23.81 12.06,20.32 22.23,20.32 25.08,17.46 33.02,17.46 33.49,16.99 IC4.24
  Bottom 0.254: S1.2 4.76,20.32 v8.89,23.81
N$10  (via drill 0.5)
  Top 0.406: IC5.5 43.18,30.48 43.81,31.11 v43.81,31.75 R14.1
  Bottom 0.254: v43.81,31.75 D100.C
N$11  (via drill 0.5)
  Top 0.406: IC3.5 33.02,30.48 33.66,31.11 v33.66,31.75 R8.1
  Bottom 0.152: v33.66,31.75 D102.C
N$12
  Top 0.254: IC4.23 35.15,17.88 34.92,18.1 25.4,18.1 22.54,20.95 12.7,20.95 9.84,24.45 S1.1
N$13  (via drill 0.5)
  Top 0.254: IC5.8 v39.37,29.93
  Top 0.406: v39.37,29.93 35.97,29.93 35.24,29.21 D2.C
  Bottom 0.152: C101.2 39.37,29.84 v39.37,29.93
N$14
  Top 0.254: IC3.3 31.75,22.54 32.07,22.23 R9.1
N$15
  Top 0.254: IC5.2 40.64,22.54 40.32,22.23 R11.2
N$16
  Top 0.254: IC5.3 41.91,22.54 42.23,22.23 R15.2
N$17  (via drill 0.6)
  Top 0.254: R17.1 v46.99,12.7
  Bottom 0.254: Q105.1 30.16,15.24 30.8,14.61 40.01,14.61 40.64,13.97 45.72,13.97 v46.99,12.7
N$18  (via drill 0.5)
  Top 0.254: v37.78,20.95 37.78,21.83 R11.1
  Bottom 0.254: Q102.5 39.05,21.59 38.42,20.95 v37.78,20.95
N$19  (via drill 0.5)
  Top 0.254: R15.1 44.69,22.3 44.77,22.23 | 44.77,21.83 R15.1 | v43.5,20.95 44.13,20.95 44.77,21.59 44.77,22.15 R15.1
  Bottom 0.254: Q101.5 v43.5,20.95
N$20  (via drill 0.5)
  Top 0.254: v27.62,20.95 27.62,21.83 R5.2
  Bottom 0.254: Q105.5 28.89,21.59 28.26,20.95 v27.62,20.95
N$21  (via drill 0.5)
  Top 0.254: 34.61,21.83 R9.2 34.61,22.15 34.61,21.59 33.97,20.95 v33.34,20.95
  Bottom 0.254: Q103.5 v33.34,20.95
N$22  (via drill 0.6)
  Top 0.254: R19.1 v46.99,8.89
  Bottom 0.254: Q103.1 34.61,17.14 35.56,18.1 47.31,18.1 48.58,16.83 48.58,10.48 v46.99,8.89
N$23  (via drill 0.6)
  Top 0.254: R16.2 v46.99,14.61
  Bottom 0.254: v46.99,14.61 40.96,14.61 40.32,15.24 Q102.1
N$24  (via drill 0.6)
  Top 0.254: R18.2 v46.99,10.79
  Bottom 0.254: v46.99,10.79 47.94,11.75 47.94,15.24 47.31,15.88 44.79,15.88 Q101.1
N$25  (via drill 0.5)
  Top 0.254: IC4.28 31.98,13.1 v31.43,12.38
  Bottom 0.254: R100.2 13.65,15.24 14.29,14.61 24.61,14.61 26.51,12.7 30.48,12.7 30.8,12.38 v31.43,12.38
N$26
  Bottom 0.254: Z1.P$1 11.11,15.24 | 11.11,15.24 D104.C | 11.11,15.24 R100.1
N$27
  Top 0.254: R20.1 LED2.A
N$28  (via drill 0.6)
  Top 0.254: v8.57,9.21 CN1.P$6
  Bottom 0.254: LED5.K v8.57,9.21
N$29
  Bottom 0.406: IC100.3 33.9,4.44 C106.2
N$30
  Top 0.406: R1.1 LED1.A
N$31
  Top 0.254: IC2.6 25.72,10.16 25.4,10.48 23.65,10.48 23.34,10.16 22.86,10.16 | 22.86,10.16 21.59,10.16 20.95,10.79 20.95,13.02 20.64,13.34 13.65,13.34 13.34,13.02 CN1.P$2 | R4.1 22.86,10.16
N$32
  Top 0.406: R23.2 52.31,47.94 | 52.31,47.94 LED4.A | 52.31,47.94 50.88,47.94 LED3.K
N$33
  Top 0.254: IC4.22 35.95,18.03 35.24,18.73 25.72,18.73 22.02,22.43 R2.2
N$34
  Top 0.254: IC2.7 26.99,10.16 26.04,11.11 23.5,11.11 23.18,10.79 22.86,10.79 | 22.86,10.79 21.91,10.79 21.59,11.11 21.59,13.34 20.95,13.97 13.02,13.97 12.06,13.02 CN1.P$3 | R4.2 22.86,10.79
O1  (via drill 0.5)
  Top 0.254: IC3.6 v31.75,29.93
  Top 0.406: v31.75,34.92 31.75,36.2 34.61,39.05 34.7,39.05 Q1.2 | R7.2 v31.75,29.93 | R23.1 46.71,49.53 Q2.3
  Bottom 0.254: v31.75,29.93 C107.1
  Bottom 0.406: v31.75,29.93 v31.75,34.92
  pour Top (isolate 0.305, no thermals): 39.37,38.1 34.29,38.1 arc-90 33.66,38.73 33.66,40.01 arc-90 34.29,40.64 36.2,40.64 arc90 36.83,41.27 36.83,61.91 arc-90 37.47,62.55 48.58,62.55 arc-90 49.21,61.91 49.21,42.55 arc-90 48.58,41.91 40.64,41.91 arc90 40.01,41.27 40.01,38.73 arc-90
O2  (via drill 0.5)
  Top 0.152: 50.8,46.35 LED3.A v50.8,46.04
  Top 0.254: IC5.6 v41.91,29.93
  Top 0.406: R13.1 v41.91,29.93 | LED4.K LED3.A
  Bottom 0.254: v41.91,29.93 C101.1
  Bottom 0.406: v41.91,29.93 v41.91,34.92 41.91,36.51 39.05,38.42 | v50.8,46.04 44.41,46.04 Q100.3
  pour Bottom (isolate 0.305, no thermals): 32.07,52.07 32.07,61.91 arc-90 32.7,62.55 40.01,62.55 arc-90 40.64,61.91 40.64,53.6 arc45 40.83,53.15 42.99,50.99 arc45 43.44,50.8 47.62,50.8 arc-90 48.26,50.16 48.26,42.55 arc-90 47.62,41.91 40.01,41.91 arc90 39.37,41.27 39.37,38.73 arc-90 38.73,38.1 28.57,38.1 arc-90 27.94,38.73 27.94,42.23 arc-90 28.57,42.86 36.2,42.86 arc90 36.83,43.5 36.83,49.9 arc45 36.64,50.35 35.75,51.25 arc45 35.3,51.44 32.7,51.44 arc-90
PWM1_A
  Top 0.254: IC4.13 43.1,13.1 43.5,12.7 R17.2
PWM1_B
  Top 0.254: IC4.14 42.79,13.9 43.5,14.61 R16.1
RXD
  Top 0.254: IC4.31 30.89,10.7 29.84,11.75 28.77,11.75 28.67,11.65 27.62,12.7 24.77,12.7 24.45,13.02 IC2.4
SCLK
  Top 0.254: J1.SCK 52.7,15.88 51.44,17.14 51.44,18.41 50.8,19.05 48.26,19.05 47.31,18.1 40.32,18.1 39.95,17.72 IC4.17
SELECT
  Top 0.254: 22.86,15.56 R3.1 | CN1.P$5 9.53,13.34 10.79,14.61 20.95,14.61 21.91,15.56 22.86,15.56 | 25.72,15.56 22.86,15.56 | 25.72,15.56 25.72,14.29 25.83,14.17 IC2.3 | IC2.2 26.99,15.56 | IC4.27 31.5,13.9 29.84,15.56 26.99,15.56 | 26.99,15.56 25.72,15.56
TXD
  Top 0.254: IC2.1 28.26,13.02 28.89,12.38 30.16,12.38 31.05,11.5 IC4.30
VDD
  Top 0.61: JP1.2 JP1.1
  Bottom 0.61: IC100.5 35.56,2.54 | 35.56,2.54 IC100.1 33.02,2.54 32.07,3.49 26.35,3.49 | C103.2 35.32,2.3 35.56,2.54 | 26.35,3.49 22.54,3.49 JP1.1 | JP1.5 26.35,3.49

### Text on the board
tPlace: 12to35V | - | + | POWER | PERICA3 | NITFC Robot Club / PROJECT-FUGU DEVICE | DEVICE ADDR | ADJ | AVR-ISP | GND | !RST | SELECT | GND | DATA- | DATA+ | GND | VCC | A | B | Z | GND | SATA with RS458 | + | - | + | -